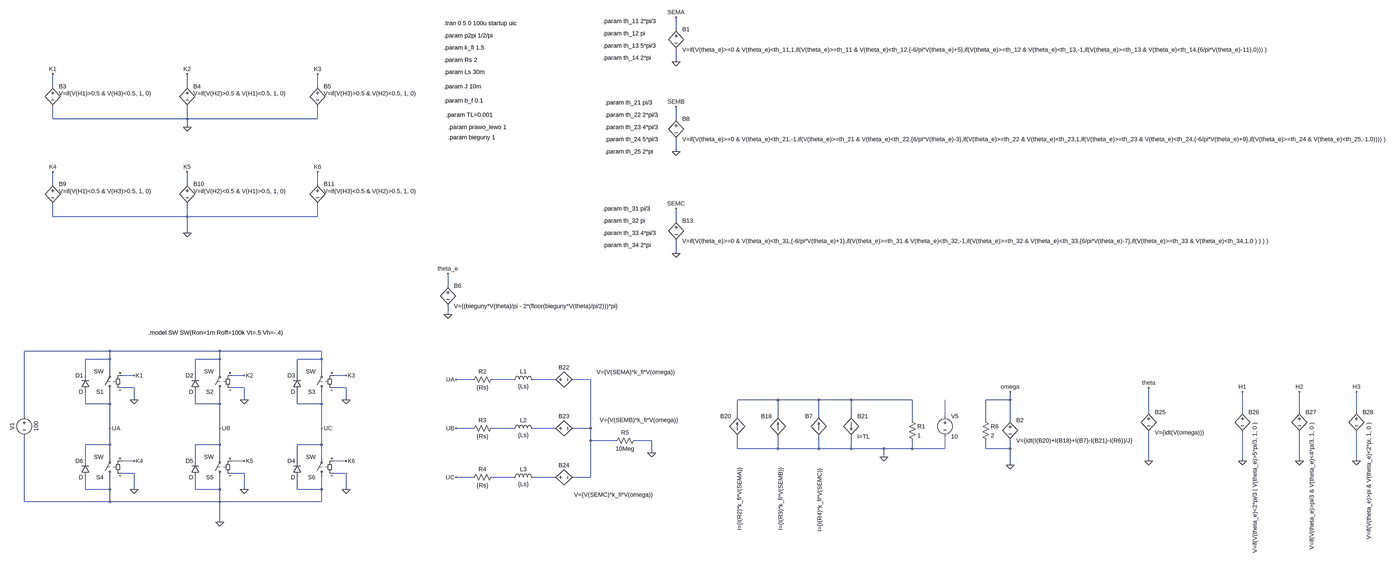
[diagram p0: schematic bldc_komutacja_todo.asc, whole sheet]
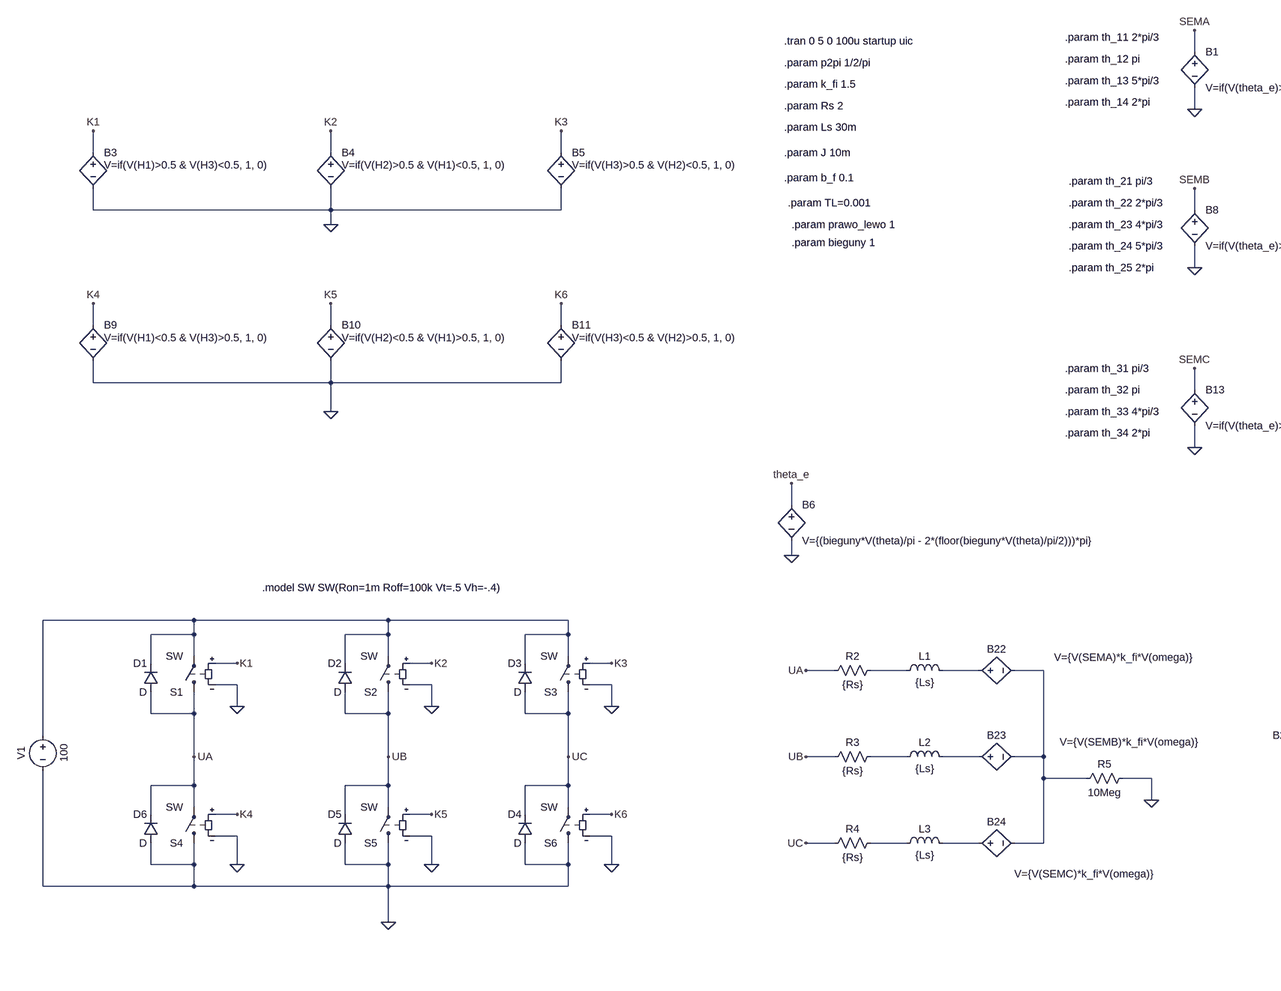
[diagram p1: schematic bldc_komutacja_todo.asc, part, row 1 of 1, column 1 of 2]
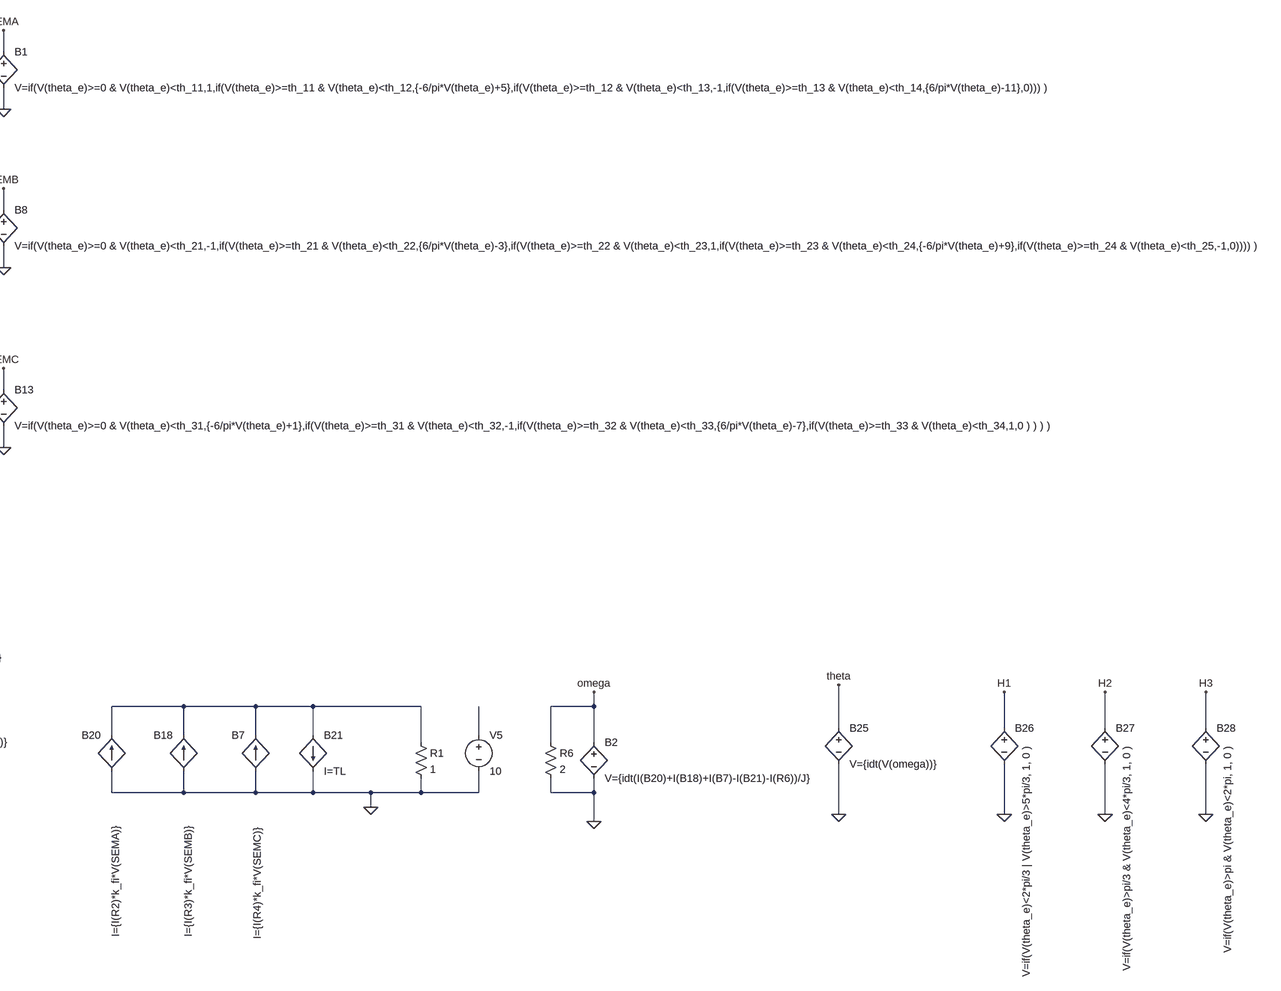
[diagram p2: schematic bldc_komutacja_todo.asc, part, row 1 of 1, column 2 of 2]
bldc_komutacja_todo.asc, the LTspice schematic file:
Version 4
SHEET 1 6572 1720
WIRE 352 -608 352 -656
WIRE 352 -480 352 -528
WIRE -2096 -384 -2096 -432
WIRE -1568 -384 -1568 -432
WIRE -1056 -384 -1056 -432
WIRE -2096 -256 -2096 -304
WIRE -1568 -256 -1568 -304
WIRE -1568 -256 -2096 -256
WIRE -1056 -256 -1056 -304
WIRE -1056 -256 -1568 -256
WIRE 352 -256 352 -304
WIRE -1568 -224 -1568 -256
WIRE 352 -128 352 -176
WIRE -2096 0 -2096 -48
WIRE -1568 0 -1568 -48
WIRE -1056 0 -1056 -48
WIRE -2096 128 -2096 80
WIRE -1568 128 -1568 80
WIRE -1568 128 -2096 128
WIRE -1056 128 -1056 80
WIRE -1056 128 -1568 128
WIRE 352 144 352 96
WIRE -1568 192 -1568 128
WIRE 352 272 352 224
WIRE -544 400 -544 352
WIRE -544 512 -544 480
WIRE -1872 656 -2208 656
WIRE -1440 656 -1872 656
WIRE -1040 656 -1440 656
WIRE -1872 688 -1872 656
WIRE -1872 688 -1968 688
WIRE -1440 688 -1440 656
WIRE -1440 688 -1536 688
WIRE -1040 688 -1040 656
WIRE -1040 688 -1136 688
WIRE -1872 736 -1872 688
WIRE -1440 736 -1440 688
WIRE -1040 736 -1040 688
WIRE -1968 752 -1968 688
WIRE -1776 752 -1824 752
WIRE -1536 752 -1536 688
WIRE -1344 752 -1392 752
WIRE -1136 752 -1136 688
WIRE -944 752 -992 752
WIRE -448 768 -512 768
WIRE -288 768 -368 768
WIRE -128 768 -208 768
WIRE 16 768 -48 768
WIRE -1776 800 -1824 800
WIRE -1344 800 -1392 800
WIRE -944 800 -992 800
WIRE -1776 848 -1776 800
WIRE -1344 848 -1344 800
WIRE -944 848 -944 800
WIRE 752 848 592 848
WIRE 912 848 752 848
WIRE 1040 848 912 848
WIRE 1280 848 1040 848
WIRE 1664 848 1664 816
WIRE 1664 848 1568 848
WIRE -1968 864 -1968 816
WIRE -1872 864 -1872 816
WIRE -1872 864 -1968 864
WIRE -1536 864 -1536 816
WIRE -1440 864 -1440 816
WIRE -1440 864 -1536 864
WIRE -1136 864 -1136 816
WIRE -1040 864 -1040 816
WIRE -1040 864 -1136 864
WIRE 2208 896 2208 800
WIRE 2576 896 2576 816
WIRE 2800 896 2800 816
WIRE 3024 896 3024 816
WIRE -2208 912 -2208 656
WIRE 592 912 592 848
WIRE 752 912 752 848
WIRE 912 912 912 848
WIRE 1040 912 1040 848
WIRE 1408 912 1408 848
WIRE 1280 928 1280 848
WIRE 1568 928 1568 848
WIRE 1664 928 1664 848
WIRE -1872 960 -1872 864
WIRE -1440 960 -1440 864
WIRE -1040 960 -1040 864
WIRE -448 960 -512 960
WIRE -288 960 -368 960
WIRE -128 960 -208 960
WIRE 16 960 16 768
WIRE 16 960 -48 960
WIRE 16 1008 16 960
WIRE 112 1008 16 1008
WIRE 256 1008 192 1008
WIRE -1872 1024 -1872 960
WIRE -1872 1024 -1968 1024
WIRE -1440 1024 -1440 960
WIRE -1440 1024 -1536 1024
WIRE -1040 1024 -1040 960
WIRE -1040 1024 -1136 1024
WIRE 592 1040 592 992
WIRE 752 1040 752 992
WIRE 752 1040 592 1040
WIRE 912 1040 912 992
WIRE 912 1040 752 1040
WIRE 1040 1040 1040 992
WIRE 1040 1040 912 1040
WIRE 1168 1040 1040 1040
WIRE 1280 1040 1280 1008
WIRE 1280 1040 1168 1040
WIRE 1408 1040 1408 992
WIRE 1408 1040 1280 1040
WIRE 1568 1040 1568 1008
WIRE 1664 1040 1664 1008
WIRE 1664 1040 1568 1040
WIRE 256 1056 256 1008
WIRE -1872 1072 -1872 1024
WIRE -1440 1072 -1440 1024
WIRE -1040 1072 -1040 1024
WIRE 1168 1072 1168 1040
WIRE -1968 1088 -1968 1024
WIRE -1776 1088 -1824 1088
WIRE -1536 1088 -1536 1024
WIRE -1344 1088 -1392 1088
WIRE -1136 1088 -1136 1024
WIRE -944 1088 -992 1088
WIRE 2208 1088 2208 976
WIRE 2576 1088 2576 976
WIRE 2800 1088 2800 976
WIRE 3024 1088 3024 976
WIRE 1664 1104 1664 1040
WIRE -1776 1136 -1824 1136
WIRE -1344 1136 -1392 1136
WIRE -944 1136 -992 1136
WIRE -448 1152 -512 1152
WIRE -288 1152 -368 1152
WIRE -128 1152 -208 1152
WIRE 16 1152 16 1008
WIRE 16 1152 -48 1152
WIRE -1968 1200 -1968 1152
WIRE -1872 1200 -1872 1152
WIRE -1872 1200 -1968 1200
WIRE -1776 1200 -1776 1136
WIRE -1536 1200 -1536 1152
WIRE -1440 1200 -1440 1152
WIRE -1440 1200 -1536 1200
WIRE -1344 1200 -1344 1136
WIRE -1136 1200 -1136 1152
WIRE -1040 1200 -1040 1152
WIRE -1040 1200 -1136 1200
WIRE -944 1200 -944 1136
WIRE -2208 1248 -2208 992
WIRE -1872 1248 -1872 1200
WIRE -1872 1248 -2208 1248
WIRE -1440 1248 -1440 1200
WIRE -1440 1248 -1872 1248
WIRE -1040 1248 -1040 1200
WIRE -1040 1248 -1440 1248
WIRE -1440 1328 -1440 1248
FLAG -544 352 theta_e
FLAG 352 -480 0
FLAG 352 -656 SEMA
FLAG -544 512 0
FLAG 352 -128 0
FLAG 352 -304 SEMB
FLAG 352 272 0
FLAG 352 96 SEMC
FLAG 1168 1072 0
FLAG 1664 816 omega
FLAG 256 1056 0
FLAG -512 768 UA
FLAG -512 960 UB
FLAG -512 1152 UC
FLAG 2208 1088 0
FLAG 2208 800 theta
FLAG 2576 1088 0
FLAG 2576 816 H1
FLAG 2800 1088 0
FLAG 2800 816 H2
FLAG 3024 1088 0
FLAG 3024 816 H3
FLAG 1664 1104 0
FLAG -944 1200 0
FLAG -1344 1200 0
FLAG -1776 1200 0
FLAG -1776 848 0
FLAG -1344 848 0
FLAG -944 848 0
FLAG -1872 960 UA
FLAG -1440 960 UB
FLAG -1040 960 UC
FLAG -1776 752 K1
FLAG -1344 752 K2
FLAG -944 752 K3
FLAG -1776 1088 K4
FLAG -1344 1088 K5
FLAG -944 1088 K6
FLAG -1568 -224 0
FLAG -2096 -432 K1
FLAG -1568 -432 K2
FLAG -1056 -432 K3
FLAG -2096 -48 K4
FLAG -1568 -48 K5
FLAG -1056 -48 K6
FLAG -1440 1328 0
FLAG -1568 192 0
SYMBOL bv 352 -624 R0
SYMATTR InstName B1
SYMATTR Value V=if(V(theta_e)>=0 & V(theta_e)<th_11,1,if(V(theta_e)>=th_11 & V(theta_e)<th_12,{-6/pi*V(theta_e)+5},if(V(theta_e)>=th_12 & V(theta_e)<th_13,-1,if(V(theta_e)>=th_13 & V(theta_e)<th_14,{6/pi*V(theta_e)-11},0))) )
SYMBOL bv -544 384 R0
SYMATTR InstName B6
SYMATTR Value V={(bieguny*V(theta)/pi - 2*(floor(bieguny*V(theta)/pi/2)))*pi}
SYMBOL bv 352 -272 R0
SYMATTR InstName B8
SYMATTR Value V=if(V(theta_e)>=0 & V(theta_e)<th_21,-1,if(V(theta_e)>=th_21 & V(theta_e)<th_22,{6/pi*V(theta_e)-3},if(V(theta_e)>=th_22 & V(theta_e)<th_23,1,if(V(theta_e)>=th_23 & V(theta_e)<th_24,{-6/pi*V(theta_e)+9},if(V(theta_e)>=th_24 & V(theta_e)<th_25,-1,0)))) )
SYMBOL bv 352 128 R0
SYMATTR InstName B13
SYMATTR Value V=if(V(theta_e)>=0 & V(theta_e)<th_31,{-6/pi*V(theta_e)+1},if(V(theta_e)>=th_31 & V(theta_e)<th_32,-1,if(V(theta_e)>=th_32 & V(theta_e)<th_33,{6/pi*V(theta_e)-7},if(V(theta_e)>=th_33 & V(theta_e)<th_34,1,0 ) ) ) )
SYMBOL bi 912 992 R180
WINDOW 0 24 80 Left 2
WINDOW 3 -4 -374 VRight 2
SYMATTR InstName B7
SYMATTR Value I={I(R4)*k_fi*V(SEMC)}
SYMBOL bi 752 992 R180
WINDOW 0 24 80 Left 2
WINDOW 3 -11 -369 VRight 2
SYMATTR InstName B18
SYMATTR Value I={I(R3)*k_fi*V(SEMB)}
SYMBOL bi 592 992 R180
WINDOW 0 24 80 Left 2
WINDOW 3 -9 -369 VRight 2
SYMATTR InstName B20
SYMATTR Value I={I(R2)*k_fi*V(SEMA)}
SYMBOL bi 1040 912 R0
SYMATTR InstName B21
SYMATTR Value I=TL
SYMBOL res -464 784 R270
WINDOW 0 32 56 VTop 2
WINDOW 3 0 56 VBottom 2
SYMATTR InstName R2
SYMATTR Value {Rs}
SYMBOL ind -304 784 R270
WINDOW 0 32 56 VTop 2
WINDOW 3 5 56 VBottom 2
SYMATTR InstName L1
SYMATTR Value {Ls}
SYMBOL bv -144 768 R270
WINDOW 0 32 56 VTop 2
WINDOW 3 45 338 VBottom 2
SYMATTR InstName B22
SYMATTR Value V={V(SEMA)*k_fi*V(omega)}
SYMBOL res -464 976 R270
WINDOW 0 32 56 VTop 2
WINDOW 3 0 56 VBottom 2
SYMATTR InstName R3
SYMATTR Value {Rs}
SYMBOL ind -304 976 R270
WINDOW 0 32 56 VTop 2
WINDOW 3 5 56 VBottom 2
SYMATTR InstName L2
SYMATTR Value {Ls}
SYMBOL bv -144 960 R270
WINDOW 0 32 56 VTop 2
WINDOW 3 48 350 VBottom 2
SYMATTR InstName B23
SYMATTR Value V={V(SEMB)*k_fi*V(omega)}
SYMBOL res -464 1168 R270
WINDOW 0 32 56 VTop 2
WINDOW 3 0 56 VBottom 2
SYMATTR InstName R4
SYMATTR Value {Rs}
SYMBOL ind -304 1168 R270
WINDOW 0 32 56 VTop 2
WINDOW 3 5 56 VBottom 2
SYMATTR InstName L3
SYMATTR Value {Ls}
SYMBOL bv -144 1152 R270
WINDOW 0 32 56 VTop 2
WINDOW 3 -53 250 VBottom 2
SYMATTR InstName B24
SYMATTR Value V={V(SEMC)*k_fi*V(omega)}
SYMBOL res 208 992 R90
WINDOW 0 0 56 VBottom 2
WINDOW 3 32 56 VTop 2
SYMATTR InstName R5
SYMATTR Value 10Meg
SYMBOL res 1264 912 R0
SYMATTR InstName R1
SYMATTR Value 1
SYMBOL bv 2576 880 R0
WINDOW 3 49 53 VRight 2
SYMATTR Value V=if(V(theta_e)<2*pi/3 | V(theta_e)>5*pi/3, 1, 0 )
SYMATTR InstName B26
SYMBOL bv 2800 880 R0
WINDOW 3 49 53 VRight 2
SYMATTR Value V=if(V(theta_e)>pi/3 & V(theta_e)<4*pi/3, 1, 0 )
SYMATTR InstName B27
SYMBOL bv 3024 880 R0
WINDOW 3 49 53 VRight 2
SYMATTR Value V=if(V(theta_e)>pi & V(theta_e)<2*pi, 1, 0 )
SYMATTR InstName B28
SYMBOL voltage -2208 896 R0
WINDOW 0 -32 56 VBottom 2
WINDOW 3 32 56 VTop 2
WINDOW 123 0 0 Left 0
WINDOW 39 0 0 Left 0
SYMATTR InstName V1
SYMATTR Value 100
SYMBOL voltage 1408 896 R0
WINDOW 123 0 0 Left 0
WINDOW 39 0 0 Left 0
SYMATTR InstName V5
SYMATTR Value 10
SYMBOL bv 2208 880 R0
SYMATTR InstName B25
SYMATTR Value V={idt(V(omega))}
SYMBOL bv 1664 912 R0
SYMATTR InstName B2
SYMATTR Value V={idt(I(B20)+I(B18)+I(B7)-I(B21)-I(R6))/J}
SYMBOL res 1552 912 R0
SYMATTR InstName R6
SYMATTR Value 2
SYMBOL sw -1872 832 R180
SYMATTR InstName S1
SYMBOL sw -1440 832 R180
SYMATTR InstName S2
SYMBOL sw -1040 832 R180
SYMATTR InstName S3
SYMBOL sw -1872 1168 R180
SYMATTR InstName S4
SYMBOL sw -1440 1168 R180
SYMATTR InstName S5
SYMBOL sw -1040 1168 R180
SYMATTR InstName S6
SYMBOL diode -1952 816 R180
WINDOW 0 24 64 Left 2
WINDOW 3 24 0 Left 2
SYMATTR InstName D1
SYMBOL diode -1520 816 R180
WINDOW 0 24 64 Left 2
WINDOW 3 24 0 Left 2
SYMATTR InstName D2
SYMBOL diode -1120 816 R180
WINDOW 0 24 64 Left 2
WINDOW 3 24 0 Left 2
SYMATTR InstName D3
SYMBOL diode -1120 1152 R180
WINDOW 0 24 64 Left 2
WINDOW 3 24 0 Left 2
SYMATTR InstName D4
SYMBOL diode -1520 1152 R180
WINDOW 0 24 64 Left 2
WINDOW 3 24 0 Left 2
SYMATTR InstName D5
SYMBOL diode -1952 1152 R180
WINDOW 0 24 64 Left 2
WINDOW 3 24 0 Left 2
SYMATTR InstName D6
SYMBOL bv -2096 -400 R0
WINDOW 3 24 44 Left 2
SYMATTR Value V=if(V(H1)>0.5 & V(H3)<0.5, 1, 0)
SYMATTR InstName B3
SYMBOL bv -1568 -400 R0
WINDOW 3 24 44 Left 2
SYMATTR Value V=if(V(H2)>0.5 & V(H1)<0.5, 1, 0)
SYMATTR InstName B4
SYMBOL bv -1056 -400 R0
WINDOW 3 24 44 Left 2
SYMATTR Value V=if(V(H3)>0.5 & V(H2)<0.5, 1, 0)
SYMATTR InstName B5
SYMBOL bv -2096 -16 R0
WINDOW 3 24 44 Left 2
SYMATTR Value V=if(V(H1)<0.5 & V(H3)>0.5, 1, 0)
SYMATTR InstName B9
SYMBOL bv -1568 -16 R0
WINDOW 3 24 44 Left 2
SYMATTR Value V=if(V(H2)<0.5 & V(H1)>0.5, 1, 0)
SYMATTR InstName B10
SYMBOL bv -1056 -16 R0
WINDOW 3 24 44 Left 2
SYMATTR Value V=if(V(H3)<0.5 & V(H2)>0.5, 1, 0)
SYMATTR InstName B11
TEXT 64 -640 Left 2 !.param th_11 2*pi/3
TEXT 64 -592 Left 2 !.param th_12 pi
TEXT 64 -544 Left 2 !.param th_13 5*pi/3
TEXT -560 -632 Left 2 !.tran 0 5 0 100u startup uic
TEXT 64 -496 Left 2 !.param th_14 2*pi
TEXT -560 -584 Left 2 !.param p2pi 1/2/pi
TEXT 72 -320 Left 2 !.param th_21 pi/3
TEXT 72 -272 Left 2 !.param th_22 2*pi/3
TEXT 72 -224 Left 2 !.param th_23 4*pi/3
TEXT 72 -176 Left 2 !.param th_24 5*pi/3
TEXT 72 -128 Left 2 !.param th_25 2*pi
TEXT 64 96 Left 2 !.param th_31 pi/3
TEXT 64 144 Left 2 !.param th_32 pi
TEXT 64 192 Left 2 !.param th_33 4*pi/3
TEXT 64 240 Left 2 !.param th_34 2*pi
TEXT -560 -536 Left 2 !.param k_fi 1.5
TEXT -560 -488 Left 2 !.param Rs 2
TEXT -560 -440 Left 2 !.param Ls 30m
TEXT -560 -384 Left 2 !.param J 10m
TEXT -560 -328 Left 2 !.param b_f 0.1
TEXT -552 -272 Left 2 !.param TL=0.001
TEXT -1720 584 Left 2 !.model SW SW(Ron=1m Roff=100k Vt=.5 Vh=-.4)
TEXT -544 -224 Left 2 !.param prawo_lewo 1
TEXT -544 -184 Left 2 !.param bieguny 1

The netlist it stands for:
* bldc_komutacja_todo.asc
B1 SEMA 0 V=if(V(theta_e)>=0 & V(theta_e)<th_11,1,if(V(theta_e)>=th_11 & V(theta_e)<th_12,{-6/pi*V(theta_e)+5},if(V(theta_e)>=th_12 & V(theta_e)<th_13,-1,if(V(theta_e)>=th_13 & V(theta_e)<th_14,{6/pi*V(theta_e)-11},0))) )
B6 theta_e 0 V={(bieguny*V(theta)/pi - 2*(floor(bieguny*V(theta)/pi/2)))*pi}
B8 SEMB 0 V=if(V(theta_e)>=0 & V(theta_e)<th_21,-1,if(V(theta_e)>=th_21 & V(theta_e)<th_22,{6/pi*V(theta_e)-3},if(V(theta_e)>=th_22 & V(theta_e)<th_23,1,if(V(theta_e)>=th_23 & V(theta_e)<th_24,{-6/pi*V(theta_e)+9},if(V(theta_e)>=th_24 & V(theta_e)<th_25,-1,0)))) )
B13 SEMC 0 V=if(V(theta_e)>=0 & V(theta_e)<th_31,{-6/pi*V(theta_e)+1},if(V(theta_e)>=th_31 & V(theta_e)<th_32,-1,if(V(theta_e)>=th_32 & V(theta_e)<th_33,{6/pi*V(theta_e)-7},if(V(theta_e)>=th_33 & V(theta_e)<th_34,1,0 ) ) ) )
B7 0 N005 I={I(R4)*k_fi*V(SEMC)}
B18 0 N005 I={I(R3)*k_fi*V(SEMB)}
B20 0 N005 I={I(R2)*k_fi*V(SEMA)}
B21 N005 0 I=TL
R2 UA N002 {Rs}
L1 N002 N003 {Ls}
B22 N003 N004 V={V(SEMA)*k_fi*V(omega)}
R3 UB N007 {Rs}
L2 N007 N008 {Ls}
B23 N008 N004 V={V(SEMB)*k_fi*V(omega)}
R4 UC N009 {Rs}
L3 N009 N010 {Ls}
B24 N010 N004 V={V(SEMC)*k_fi*V(omega)}
R5 0 N004 10Meg
R1 N005 0 1
B26 H1 0 V=if(V(theta_e)<2*pi/3 | V(theta_e)>5*pi/3, 1, 0 )
B27 H2 0 V=if(V(theta_e)>pi/3 & V(theta_e)<4*pi/3, 1, 0 )
B28 H3 0 V=if(V(theta_e)>pi & V(theta_e)<2*pi, 1, 0 )
V1 N001 0 100
V5 N006 0 10
B25 theta 0 V={idt(V(omega))}
B2 omega 0 V={idt(I(B20)+I(B18)+I(B7)-I(B21)-I(R6))/J}
R6 omega 0 2
S1 UA N001 K1 0 SW
S2 UB N001 K2 0 SW
S3 UC N001 K3 0 SW
S4 0 UA K4 0 SW
S5 0 UB K5 0 SW
S6 0 UC K6 0 SW
D1 UA N001 D
D2 UB N001 D
D3 UC N001 D
D4 0 UC D
D5 0 UB D
D6 0 UA D
B3 K1 0 V=if(V(H1)>0.5 & V(H3)<0.5, 1, 0)
B4 K2 0 V=if(V(H2)>0.5 & V(H1)<0.5, 1, 0)
B5 K3 0 V=if(V(H3)>0.5 & V(H2)<0.5, 1, 0)
B9 K4 0 V=if(V(H1)<0.5 & V(H3)>0.5, 1, 0)
B10 K5 0 V=if(V(H2)<0.5 & V(H1)>0.5, 1, 0)
B11 K6 0 V=if(V(H3)<0.5 & V(H2)>0.5, 1, 0)
.model D D
.lib standard.dio
.param th_11 2*pi/3
.param th_12 pi
.param th_13 5*pi/3
.tran 0 5 0 100u startup uic
.param th_14 2*pi
.param p2pi 1/2/pi
.param th_21 pi/3
.param th_22 2*pi/3
.param th_23 4*pi/3
.param th_24 5*pi/3
.param th_25 2*pi
.param th_31 pi/3
.param th_32 pi
.param th_33 4*pi/3
.param th_34 2*pi
.param k_fi 1.5
.param Rs 2
.param Ls 30m
.param J 10m
.param b_f 0.1
.param TL=0.001
.model SW SW(Ron=1m Roff=100k Vt=.5 Vh=-.4)
.param prawo_lewo 1
.param bieguny 1
.backanno
.end